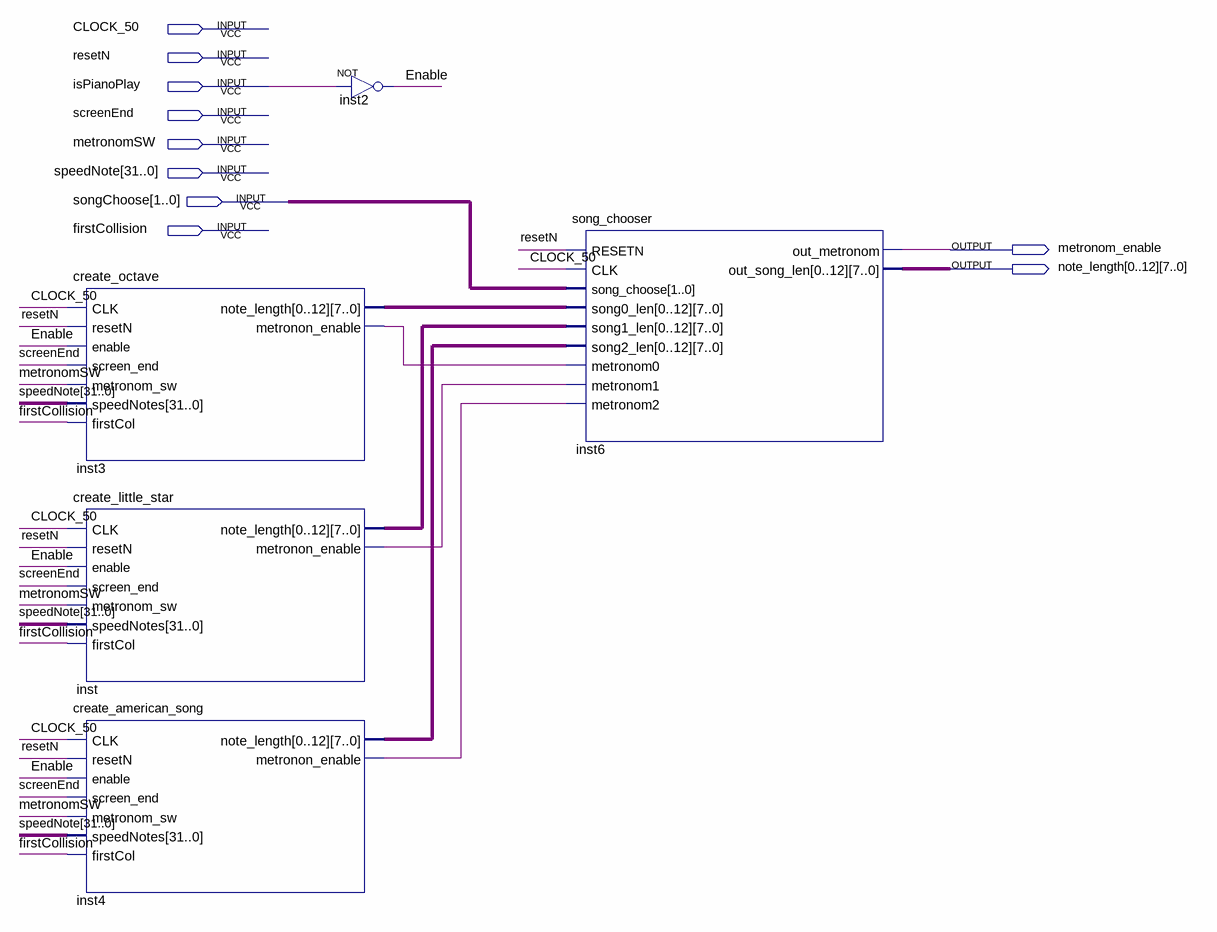
[diagram p0: schematic sheet]
// Quartus schematic createSong_top.bdf as structural Verilog: 5 symbols, 10 pins
module createSong_top (
  input  CLOCK_50,
  input  resetN,
  input  isPianoPlay,
  input  screenEnd,
  input  metronomSW,
  input  [31:0] speedNote,
  input  [1:0] songChoose,
  input  firstCollision,
  output metronom_enable,
  output [7:0] note_length_0,
  output [7:0] note_length_1,
  output [7:0] note_length_2,
  output [7:0] note_length_3,
  output [7:0] note_length_4,
  output [7:0] note_length_5,
  output [7:0] note_length_6,
  output [7:0] note_length_7,
  output [7:0] note_length_8,
  output [7:0] note_length_9,
  output [7:0] note_length_10,
  output [7:0] note_length_11,
  output [7:0] note_length_12
);

  wire Enable, inst3_metronon_enable, inst4_metronon_enable, inst_metronon_enable;
  wire [103:0] inst3_note_length, inst4_note_length, inst_note_length;

  create_octave inst3 (
    .CLK(CLOCK_50), .resetN(resetN), .enable(Enable), .screen_end(screenEnd), .metronom_sw(metronomSW),
    .speedNotes(speedNote), .firstCol(firstCollision), .note_length(inst3_note_length),
    .metronon_enable(inst3_metronon_enable));
  create_little_star inst (
    .CLK(CLOCK_50), .resetN(resetN), .enable(Enable), .screen_end(screenEnd), .metronom_sw(metronomSW),
    .speedNotes(speedNote), .firstCol(firstCollision), .note_length(inst_note_length),
    .metronon_enable(inst_metronon_enable));
  create_american_song inst4 (
    .CLK(CLOCK_50), .resetN(resetN), .enable(Enable), .screen_end(screenEnd), .metronom_sw(metronomSW),
    .speedNotes(speedNote), .firstCol(firstCollision), .note_length(inst4_note_length),
    .metronon_enable(inst4_metronon_enable));
  not inst2 (Enable, isPianoPlay);
  song_chooser inst6 (
    .RESETN(resetN), .CLK(CLOCK_50), .song_choose(songChoose), .song0_len(inst3_note_length),
    .song1_len(inst_note_length), .song2_len(inst4_note_length), .metronom0(inst3_metronon_enable),
    .metronom1(inst_metronon_enable), .metronom2(inst4_metronon_enable), .out_metronom(metronom_enable),
    .out_song_len({note_length_0, note_length_1, note_length_2, note_length_3, note_length_4, note_length_5, note_length_6, note_length_7, note_length_8, note_length_9, note_length_10, note_length_11, note_length_12}));
endmodule
